# Altium schematic sheet 01_Index_(Rev.B).SchDoc
size A4; Revision: B; SheetNumber: 1; SheetTotal: 4
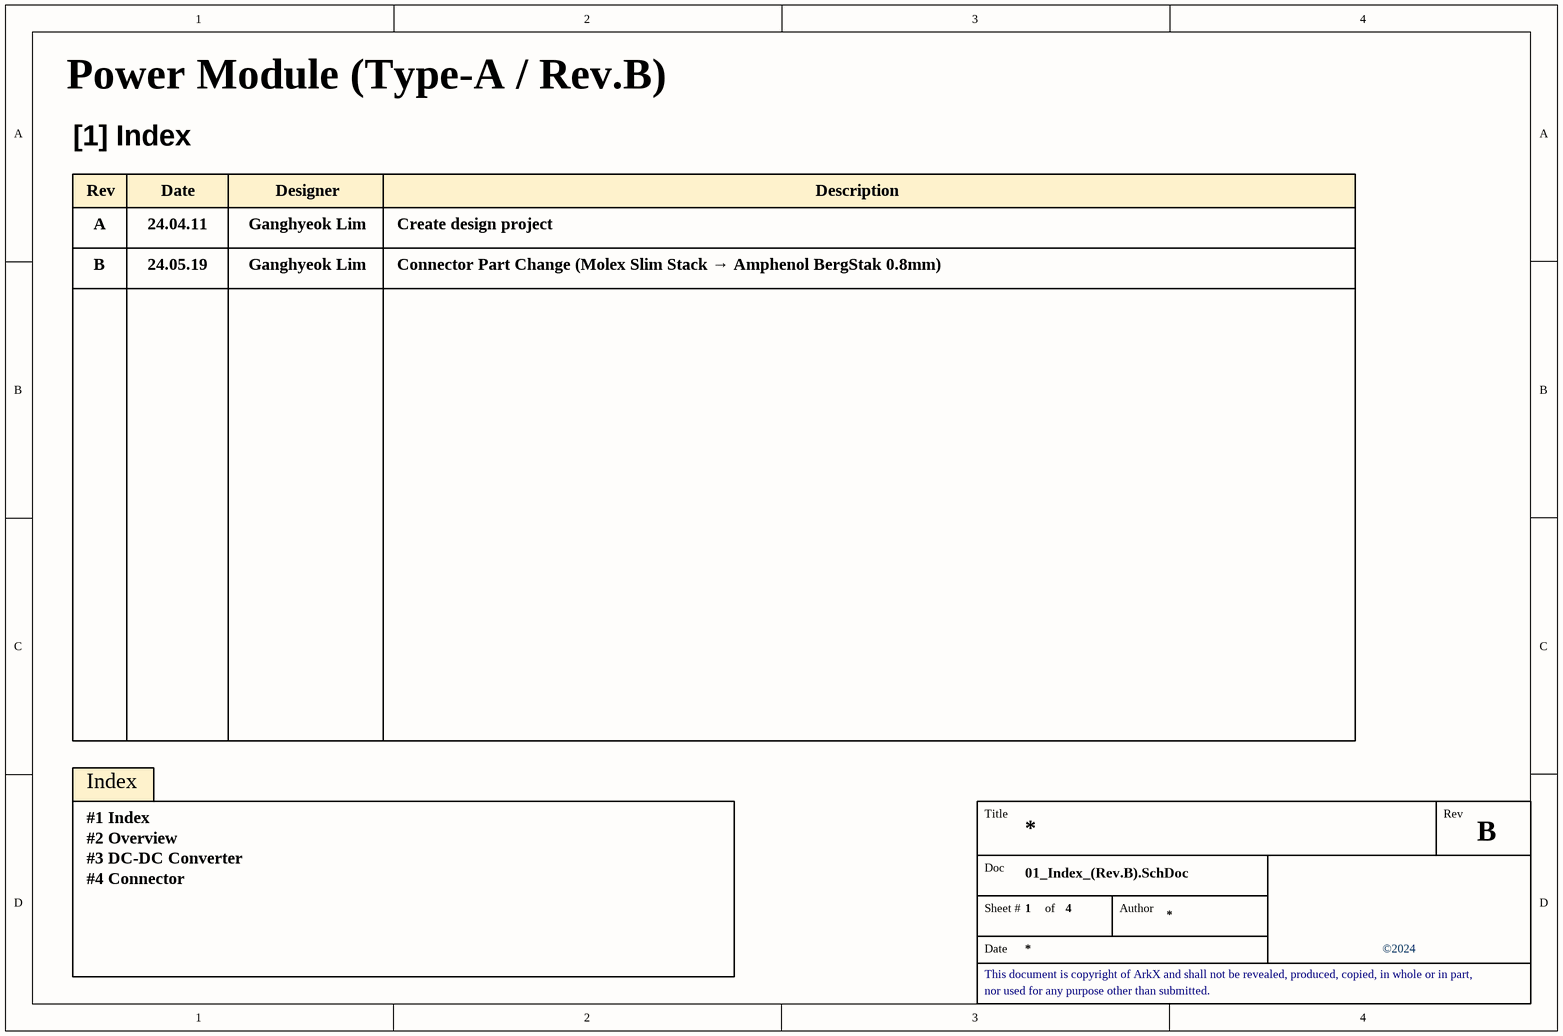
[diagram p0: 01_Index_(Rev.B).SchDoc]

## Notes on the sheet
- Power Module (Type-A / Rev.B)
- [1] Index
- Rev
- A
- 24.04.11
- Date
- Ganghyeok Lim
- Designer
- Create design project
- Description
- B
- 24.05.19
- Connector Part Change (Molex Slim Stack → Amphenol BergStak 0.8mm)
- Index
- #1 Index
- #2 Overview
- #3 DC-DC Converter
- #4 Connector
- Title
- Doc
- Sheet #
- of
- Author
- This document is copyright of ArkX and shall not be revealed, produced, copied, in whole or in part,
- ©2024
- nor used for any purpose other than submitted.